# EAGLE board EVO256x64 (EAGLE 7.4.0)
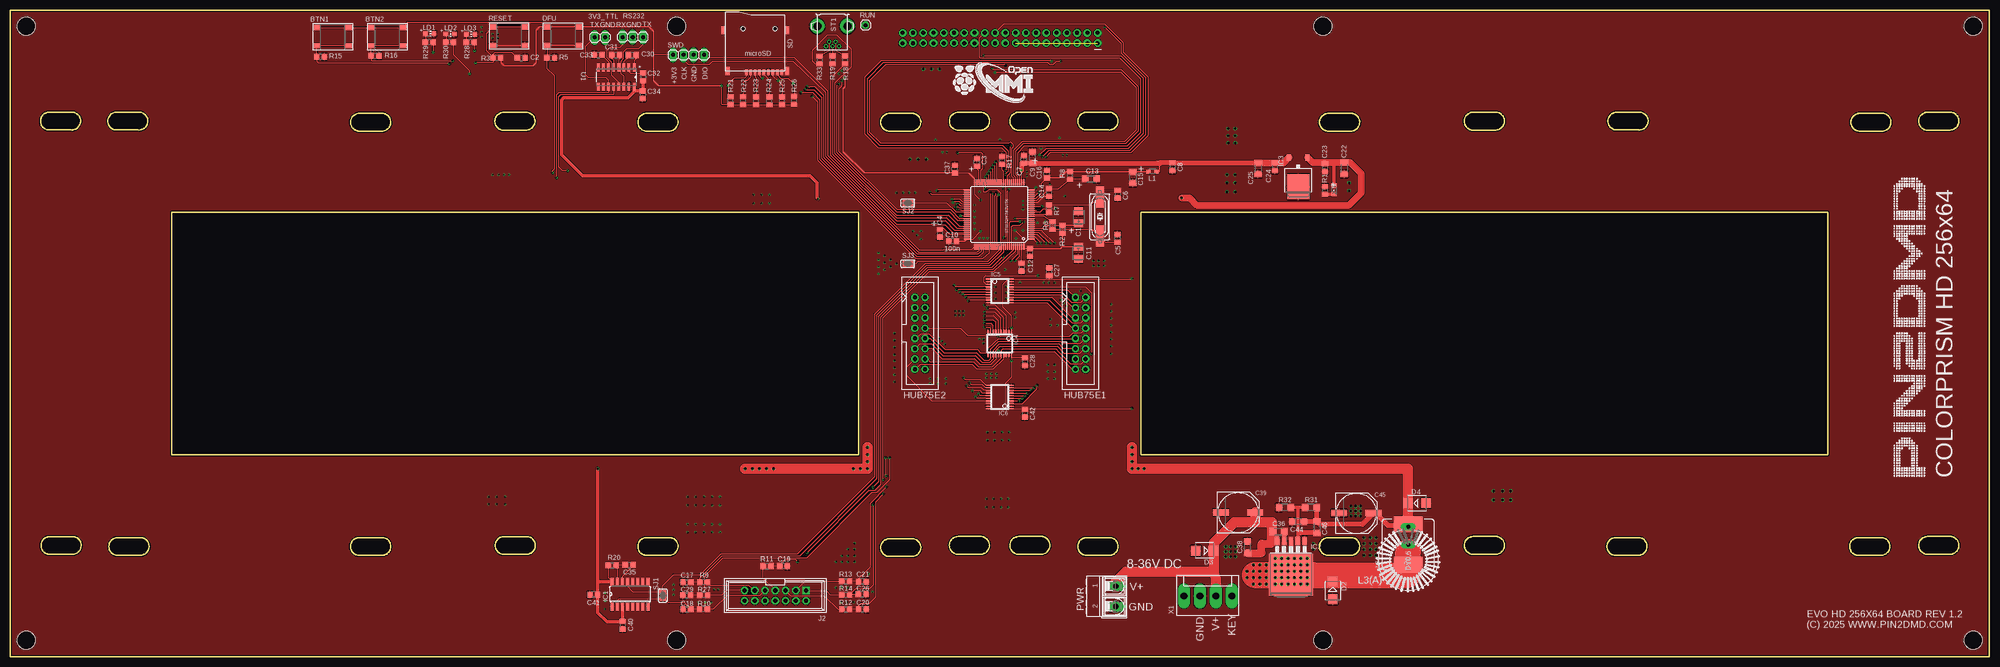
[diagram p1: board, top side]
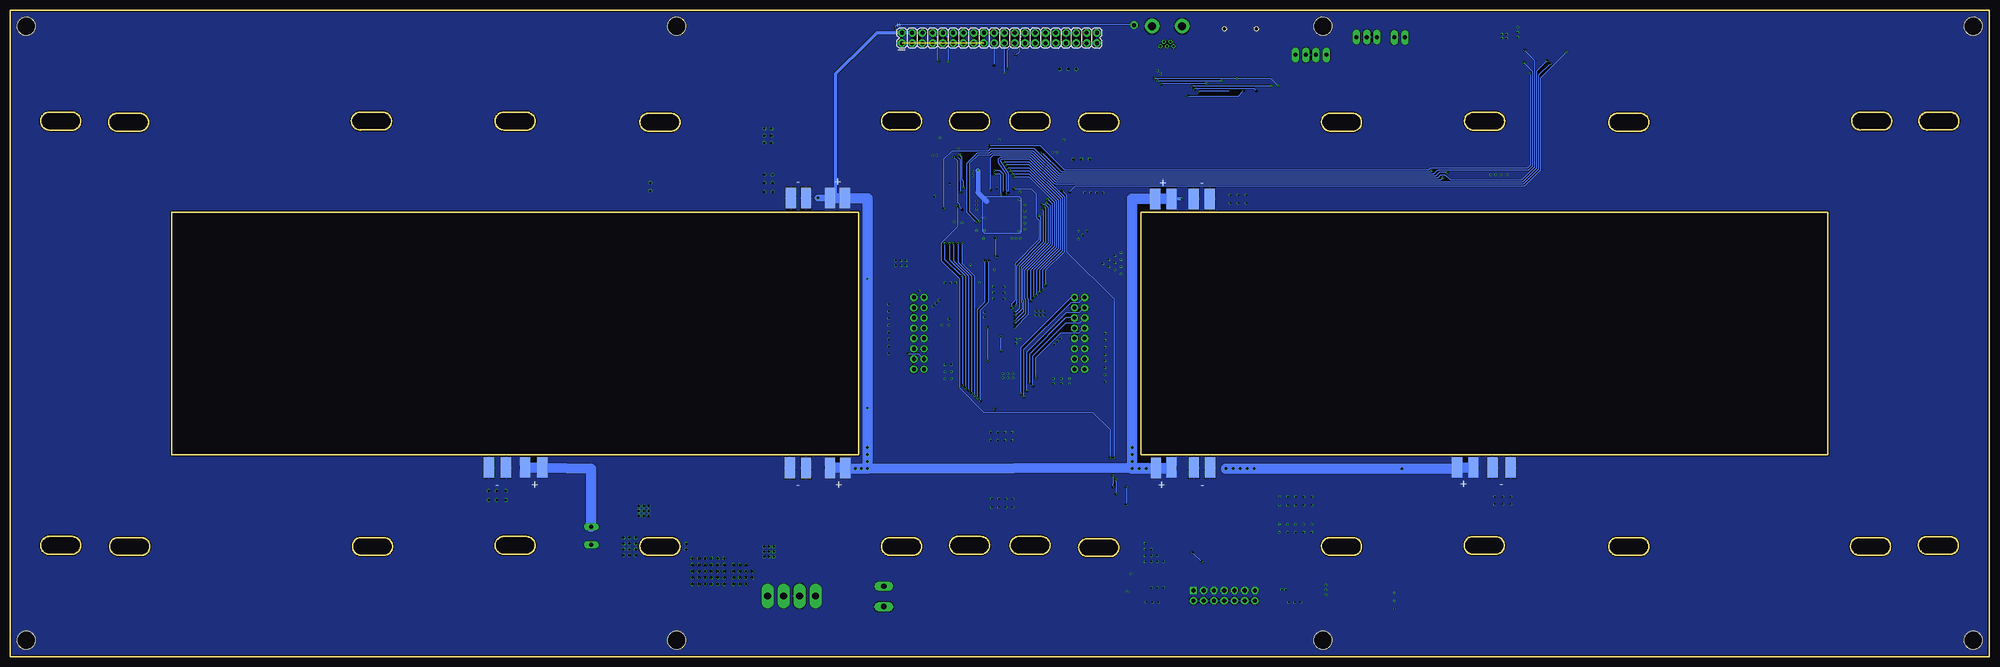
[diagram p2: board, bottom side, seen from below]

Size 490 x 160 mm. Coordinates in mm from the lower left corner, seen from the top.
Outline: 150 segments
Copper layers (1*16): Top 0.035mm / dielectric 1.6mm / Bottom 0.035mm
Design rules "jlcpcb-2layers": minimum track width 5mil, minimum drill 0.3mm, track to track 5mil, track to pad 5mil, pad to pad 5mil, via to via 5mil, smd to smd 5mil, copper to edge 0.2mm, drill to drill 6mil, minimum pad ring 10mil, minimum via ring 3mil, stop-mask expansion 4mil, vias tented up to drill 0mil, thermal gap 10mil
Holes 4.5 mm at 4,156 165,156 486,156 486,4 165,4 4,4 325,156 325,4

## Footprints (pad centres in the part's own frame; a part is rotated, then mirrored left to right if it is on the bottom)
1X02 = drill 1.016 long: 1 -1.27,0; 2 1.27,0
430152043826 = smd 1.55 x 1.3: 1 -3.975,2.25; 2 -3.975,-2.25; 3 3.975,2.25; 4 3.975,-2.25
CT3528 = smd 2 x 2.2: + -1.5,0; - 1.5,0
C0805 = smd 1.3 x 1.5: 1 -0.95,0; 2 0.95,0
C1206 = smd 1.6 x 1.8: 1 -1.4,0; 2 1.4,0
PANASONIC_G = smd 3.9 x 1.6: + 4.25,0; - -4.25,0
SMB = smd 2.4 x 2.4: A 2.2,0; C -2.2,0
2X08-IDC = drill 1 pad 1.778: 1 -1.27,8.89; 2 1.27,8.89; 3 -1.27,6.35; 4 1.27,6.35; 5 -1.27,3.81; 6 1.27,3.81; 7 -1.27,1.27; 8 1.27,1.27; 9 -1.27,-1.27; 10 1.27,-1.27; 11 -1.27,-3.81; 12 1.27,-3.81; 13 -1.27,-6.35; 14 1.27,-6.35; 15 -1.27,-8.89; 16 1.27,-8.89
SO16 = smd 0.66 x 2.032: 1 -4.445,-3.073; 2 -3.175,-3.073; 3 -1.905,-3.073; 4 -0.635,-3.073; 5 0.635,-3.073; 6 1.905,-3.073; 7 3.175,-3.073; 8 4.445,-3.073; 9 4.445,3.073; 10 3.175,3.073; 11 1.905,3.073; 12 0.635,3.073; 13 -0.635,3.073; 14 -1.905,3.073; 15 -3.175,3.073; 16 -4.445,3.073
TO263-5 = smd 1.067 x 2.159: 1 -3.404,-5.791; 2 -1.702,-5.791; 3 0,-5.791; 4 1.702,-5.791; 5 3.404,-5.791 | smd 10.8 x 10.41: 6 0,2.54
TO252 = smd 1 x 1.6: 1 -2.28,-4.8; 2 2.28,-4.8 | smd 5.4 x 6.2: 3 0,2.5
TSSOP20 = smd 0.305 x 0.991: 1 -2.925,-2.918; 2 -2.275,-2.918; 3 -1.625,-2.918; 4 -0.975,-2.918; 5 -0.325,-2.918; 6 0.325,-2.918; 7 0.975,-2.918; 8 1.625,-2.918; 9 2.275,-2.918; 10 2.925,-2.918; 11 2.925,2.918; 12 2.275,2.918; 13 1.625,2.918; 14 0.975,2.918; 15 0.325,2.918; 16 -0.325,2.918; 17 -0.975,2.918; 18 -1.625,2.918; 19 -2.275,2.918; 20 -2.925,2.918
2X20 = drill 1.016 pad 1.88: 1 0,0; 2 0,2.54; 3 2.54,0; 4 2.54,2.54; 5 5.08,0; 6 5.08,2.54; 7 7.62,0; 8 7.62,2.54; 9 10.16,0; 10 10.16,2.54; 11 12.7,0; 12 12.7,2.54; 13 15.24,0; 14 15.24,2.54; 15 17.78,0; 16 17.78,2.54; 17 20.32,0; 18 20.32,2.54; 19 22.86,0; 20 22.86,2.54; 21 25.4,0; 22 25.4,2.54; 23 27.94,0; 24 27.94,2.54; 25 30.48,0; 26 30.48,2.54; 27 33.02,0; 28 33.02,2.54; 29 35.56,0; 30 35.56,2.54; 31 38.1,0; 32 38.1,2.54; 33 40.64,0; 34 40.64,2.54; 35 43.18,0; 36 43.18,2.54; 37 45.72,0; 38 45.72,2.54; 39 48.26,0; 40 48.26,2.54
PINSHRD_PTH_2X07 = drill 1.016 square: 1 -7.62,-1.27 | drill 1.016 octagon: 2 -7.62,1.27; 3 -5.08,-1.27; 4 -5.08,1.27; 5 -2.54,-1.27; 6 -2.54,1.27; 7 0,-1.27; 8 0,1.27; 9 2.54,-1.27; 10 2.54,1.27; 11 5.08,-1.27; 12 5.08,1.27; 13 7.62,-1.27; 14 7.62,1.27
L2012C = smd 1 x 1: 1 -1,0; 2 1,0
ED16 = drill 1.016 long: 1 -8.255,0; 2 -3.81,0
SRR1206 = smd 4 x 7: 1 -5,0; 2 5,0
CHIP-LED0805 = smd 1.2 x 1.2: A 0,-1.05; C 0,1.05
SMD2,54-5,08 = smd 2.54 x 5.08: 1 0,0
CHIPLED_0805 = smd 1.2 x 1.2: A 0,-1.05; C 0,1.05
AK500/2-H = drill 1.321 long: 1 -2.515,0; 2 2.515,0
HC49UP = smd 5.334 x 1.93: 1 -4.826,0; 2 4.826,0
R0805 = smd 1.3 x 1.5: 1 -0.95,0; 2 0.95,0
R1206 = smd 1.6 x 1.803: 1 -1.422,0; 2 1.422,0
1X03 = drill 1.016 long: 1 -2.54,0; 2 0,0; 3 2.54,0
1X01 = drill 1.016 octagon: 1 0,0
MR**-AP*03** = smd 0.6 x 1.5: CARD_DETECTION -6.55,0.3; CLK -2.15,0.3; CMD 0.05,0.3; DAT0 -4.35,0.3; DAT1 -5.45,0.3; DAT2 2.25,0.3; DAT3/CS 1.15,0.3; GND -3.25,0.3; VCC -1.05,0.3 | smd 1 x 2: SHD_1 -7.85,0; SHD_2 6.85,0; SHD_3 -7.85,-10.1; SHD_4 7.85,-10.1 | hole 1: -4.95,-10.5; 3.05,-10.5
SJ = smd 1.168 x 1.6: 1 -0.762,0; 2 0.762,0
USBMINI = drill 0.5: 1 -1.6,3; 2 -0.8,1.8; 3 0,3; 4 0.8,1.8; 5 1.6,3 | drill 2: N1 -3.7,-2; N2 3.7,-2
LQFP100 = smd 1.5 x 0.4: 1 -8,6.075; 25 -8,-6.075; 51 8,-6.075; 75 8,6.075 | smd 1.5 x 0.25: 2 -8,5.5; 3 -8,5; 4 -8,4.5; 5 -8,4; 6 -8,3.5; 7 -8,3; 8 -8,2.5; 9 -8,2; 10 -8,1.5; 11 -8,1; 12 -8,0.5; 13 -8,0; 14 -8,-0.5; 15 -8,-1; 16 -8,-1.5; 17 -8,-2; 18 -8,-2.5; 19 -8,-3; 20 -8,-3.5; 21 -8,-4; 22 -8,-4.5; 23 -8,-5; 24 -8,-5.5; 52 8,-5.5; 53 8,-5; 54 8,-4.5; 55 8,-4; 56 8,-3.5; 57 8,-3; 58 8,-2.5; 59 8,-2; 60 8,-1.5; 61 8,-1; 62 8,-0.5; 63 8,0; 64 8,0.5; 65 8,1; 66 8,1.5; 67 8,2; 68 8,2.5; 69 8,3; 70 8,3.5; 71 8,4; 72 8,4.5; 73 8,5; 74 8,5.5 | smd 0.4 x 1.5: 26 -6.075,-8; 50 6.075,-8; 76 6.075,8; 100 -6.075,8 | smd 0.25 x 1.5: 27 -5.5,-8; 28 -5,-8; 29 -4.5,-8; 30 -4,-8; 31 -3.5,-8; 32 -3,-8; 33 -2.5,-8; 34 -2,-8; 35 -1.5,-8; 36 -1,-8; 37 -0.5,-8; 38 0,-8; 39 0.5,-8; 40 1,-8; 41 1.5,-8; 42 2,-8; 43 2.5,-8; 44 3,-8; 45 3.5,-8; 46 4,-8; 47 4.5,-8; 48 5,-8; 49 5.5,-8; 77 5.5,8; 78 5,8; 79 4.5,8; 80 4,8; 81 3.5,8; 82 3,8; 83 2.5,8; 84 2,8; 85 1.5,8; 86 1,8; 87 0.5,8; 88 0,8; 89 -0.5,8; 90 -1,8; 91 -1.5,8; 92 -2,8; 93 -2.5,8; 94 -3,8; 95 -3.5,8; 96 -4,8; 97 -4.5,8; 98 -5,8; 99 -5.5,8
1X04 = drill 1.016 long: 1 -3.81,0; 2 -1.27,0; 3 1.27,0; 4 3.81,0
SOIC127P600X175-16N = smd 2.057 x 0.61: 1 -4.801,8.89; 2 -4.801,7.62; 3 -4.801,6.35; 4 -4.801,5.08; 5 -4.801,3.81; 6 -4.801,2.54; 7 -4.801,1.27; 8 -4.801,0; 9 0,0; 10 0,1.27; 11 0,2.54; 12 0,3.81; 13 0,5.08; 14 0,6.35; 15 0,7.62; 16 0,8.89
KK-156-4 = drill 1.7 pad 2.184 long: 1 -5.94,0; 2 -1.98,0; 3 1.98,0; 4 5.94,0

## Placement (x,y rotation side)
3V3_TTL  [1X02]  146,153.25 0 top
BTN1  430152043826  [430152043826]  79.89,153.42 180 top
BTN2  430152043826  [430152043826]  93.38,153.42 180 top
C1  1u  [CT3528]  264.49,108.74 90 top
C2  100n  [C0805]  126.54,148.18 0 top
C3  2u2  [C0805]  239.35,122.31 90 top
C4  2u2  [C0805]  230.22,104.82 270 top
C5  22p  [C0805]  274.19,103.5 90 top
C6  22p  [C0805]  274.21,114.47 270 top
C7  100n  [C0805]  250.97,123.06 90 top
C8  100n  [C0805]  287.76,121.25 270 top
C9  2u2  [C1206]  253.11,123.51 90 top
C10  100n  [C0805]  233.33,102.78 180 top
C11  2u2  [CT3528]  264.5,99.92 270 top
C12  100n  [C0805]  252.45,100.02 270 top
C13  1u  [C1206]  267.56,118.26 0 top
C14  100n  [C0805]  257.19,114.88 270 top
C15  1u  [C1206]  277.94,118.55 270 top
C16  100n  [C0805]  256.64,119.42 90 top
C17  47pF  [C0805]  167.55,18.41 0 top
C18  47pF  [C0805]  167.58,11.69 0 top
C19  47pF  [C0805]  191.47,22.42 180 top
C20  47pF  [C0805]  210.99,11.69 180 top
C21  47pF  [C0805]  210.99,18.54 180 top
C22  2u2  [C1206]  330.3,120.86 270 top
C23  100n  [C0805]  325.51,121.03 270 top
C24  100n  [C0805]  313.13,121.24 270 top
C25  2u2  [C1206]  308.95,120.81 270 top
C26  47pF  [C0805]  210.96,15.39 180 top
C27  100n  [C0805]  257.25,95.25 90 top
C28  100n  [C0805]  251.25,73 270 top
C29  47pF  [C0805]  167.51,15.16 0 top
C30  1u  [C0805]  154,148.89 0 top
C31  1u  [C0805]  149.91,148.89 0 top
C32  1u  [C0805]  156.69,143.47 270 top
C33  1u  [C0805]  145.62,148.91 0 top
C34  100n  [C0805]  156.61,139.05 270 top
C35  47p  [C0805]  153.26,22.67 0 top
C36  1uF  [C1206]  313.99,30.98 0 top
C37  100n  [C0805]  233.9,120.64 90 top
C38  1uF  [C1206]  306.33,27.03 90 top
C39  220uF/50V  [PANASONIC_G]  304.01,35.67 0 top
C40  100n  [C0805]  151.64,7.78 270 top
C41  100n  [C0805]  144.52,15.33 180 top
C42  100n  [C0805]  251.25,60.25 270 top
C44  1uF  [C1206]  318.81,33.38 180 top
C45  330uF/25V  [PANASONIC_G]  333.28,35.5 0 top
C46  1uF  [C1206]  323.52,32.03 270 top
D2  SK54  [SMB]  327.42,16.37 270 top
D3  SK54  [SMB]  295.69,26.21 180 top
D4  SK54  [SMB]  348.33,37.98 0 top
DFU  430152043826  [430152043826]  136.86,153.58 0 top
HUB75E1  RGB  [2X08-IDC]  265,80 0 top
HUB75E2  RGB  [2X08-IDC]  225.25,80 0 top
IC1  74LS123D  [SO16]  153.49,15.47 0 top
IC2  XL4015  [TO263-5]  317.09,22.82 180 top
IC3  TS 2940 CP33  [TO252]  318.92,118.73 180 top
IC4  74245PW  [TSSOP20]  245,77.5 180 top
IC5  74245PW  [TSSOP20]  245,90.5 270 top
IC6  74245PW  [TSSOP20]  245,64.25 90 top
J1  RASPBERRYPI-40-PIN  [2X20]  269.24,151.83 0 bottom
J2  CON_HEADER_2X07-PTH-SHROUDED  [PINSHRD_PTH_2X07]  189.44,15.09 180 top
L1  FCM1608KF-601T03  [L2012C]  282.78,120 180 top
L3(A)  47uH/5A  [ED16]  346.13,23.88 270 top
L3A  [SRR1206]  346.08,27.73 90 top
LD1  red  [CHIP-LED0805]  103.87,154.17 270 top
LD2  yellow  [CHIP-LED0805]  108.94,154.1 270 top
LD3  blue  [CHIP-LED0805]  114,154.04 270 top
PAD1  [SMD2,54-5,08]  206.34,46.72 0 bottom
PAD2  [SMD2,54-5,08]  202.49,46.75 0 bottom
PAD3  [SMD2,54-5,08]  196.94,46.79 0 bottom
PAD4  [SMD2,54-5,08]  192.92,46.79 0 bottom
PAD5  [SMD2,54-5,08]  283.22,46.68 180 bottom
PAD6  [SMD2,54-5,08]  287.01,46.68 180 bottom
PAD7  [SMD2,54-5,08]  292.96,46.72 180 bottom
PAD8  [SMD2,54-5,08]  296.98,46.73 180 bottom
PAD9  [SMD2,54-5,08]  286.99,113.47 180 bottom
PAD10  [SMD2,54-5,08]  283.38,113.49 180 bottom
PAD11  [SMD2,54-5,08]  292.93,113.47 180 bottom
PAD12  [SMD2,54-5,08]  296.71,113.47 180 bottom
PAD13  [SMD2,54-5,08]  206.5,113.25 0 bottom
PAD14  [SMD2,54-5,08]  202.5,113.25 0 bottom
PAD15  [SMD2,54-5,08]  197,113.25 0 bottom
PAD16  [SMD2,54-5,08]  193,113.25 0 bottom
PAD17  [SMD2,54-5,08]  131.75,46.75 0 bottom
PAD18  [SMD2,54-5,08]  127.75,46.75 0 bottom
PAD19  [SMD2,54-5,08]  123,46.75 0 bottom
PAD20  [SMD2,54-5,08]  118.5,46.75 0 bottom
PAD21  [SMD2,54-5,08]  362.5,46.75 0 bottom
PAD22  [SMD2,54-5,08]  358.25,46.75 0 bottom
PAD23  [SMD2,54-5,08]  371.5,46.75 0 bottom
PAD24  [SMD2,54-5,08]  367.25,46.75 0 bottom
POWER  Power  [CHIPLED_0805]  327.75,115.52 180 top
PWR  [AK500/2-H]  273.68,14.88 270 top
Q1  8MHz  [HC49UP]  269.8,108.88 270 top
R1  470  [R0805]  325.53,115.35 270 top
R2  0R  [R0805]  260.56,105.74 270 top
R3  100k  [R0805]  120.51,148.18 0 top
R4  47R  [R0805]  250.39,96.38 270 top
R5  100k  [R0805]  133.84,148.18 0 top
R6  0R  [R0805]  258.02,106.69 90 top
R7  220R  [R0805]  257.19,110.84 270 top
R8  47R  [R0805]  262.4,119.09 90 top
R9  220  [R0805]  171.73,18.42 180 top
R10  220  [R0805]  171.67,11.67 180 top
R11  220  [R0805]  187.39,22.41 0 top
R12  220  [R0805]  206.89,11.69 0 top
R13  220  [R0805]  206.86,18.6 0 top
R14  220  [R0805]  206.85,15.33 0 top
R15  100k  [R0805]  76.87,148.5 0 top
R16  100k  [R0805]  90.36,148.66 0 top
R17  10k  [R0805]  245.6,122.8 270 top
R18  22  [R0805]  206.72,147.7 270 top
R19  22  [R0805]  203.61,147.7 270 top
R20  1k  [R0805]  149.08,22.63 0 top
R21  10k  [R0805]  178.32,137.58 90 top
R22  10k  [R0805]  181.51,137.58 90 top
R23  10k  [R0805]  184.7,137.54 90 top
R24  10k  [R0805]  187.96,137.52 90 top
R25  10k  [R0805]  191.14,137.57 90 top
R26  10k  [R0805]  194.13,137.64 90 top
R27  220  [R0805]  171.7,15.19 180 top
R28  680  [R0805]  113.93,152.03 180 top
R29  680  [R0805]  103.79,152.05 180 top
R30  680  [R0805]  108.82,152.03 180 top
R31  11k  [R1206]  322.08,36.91 0 top
R32  3k9  [R1206]  315.56,36.91 0 top
R33  0R  [R0805]  200.35,147.66 270 top
RESET  430152043826  [430152043826]  123.53,153.58 0 top
RS232  [1X03]  154.16,153.32 180 top
RUN  [1X01]  211.75,156.29 0 top
SD  [MR**-AP*03**]  184.47,144.92 180 top
SJ1  [SJ]  161.58,15.13 270 top
SJ2  [SJ]  222.25,112.25 0 top
SJ3  [SJ]  222.25,97.25 0 top
ST1  Mini-USB  [USBMINI]  203.57,154.01 180 top
STM32H743VIT6  STM32  [LQFP100]  244.87,109.42 180 top
SWD  [1X04]  167.95,148.9 0 top
U1  MAX232D  [SOIC127P600X175-16N]  145.6,141.01 270 top
X1  [KK-156-4]  296.5,15 0 top

## Tracks (layer width: path | path; a pad name or v marks a point on that pad's centre or on a via)
3.3V  (1 unrouted)
+3V3  (via drill 0.3, 0.34 pad 0.25)
  Top 0.254: 260.58,101.52 260.69,101.41 | 238.8,118.3 238.79,118.3 STM32H743VIT6.50 238.79,114.45 v240.25,113 | STM32H743VIT6.75 238.34,103.34 v240.25,105.25 | v248.75,105.5 250.94,103.31 STM32H743VIT6.100 251.4,100.97 C12.1 | STM32H743VIT6.11 v248.78,108.42 v248.77,108.41 | STM32H743VIT6.27 250.37,119.83 v250.41,120.35 | SWD.1 159.36,148.9 159.25,149.01 | 315.31,122.2 C24.1 arc45 C24.1 | 308.63,122.2 308.93,122.2 arc45 C25.1
  Top 0.305: 250.44,121.87 C7.1 | v176.13,141.25 176.13,136.81 176.31,136.63 R21.1 R22.1 | 185.66,145.06 185.66,144.76 SD.VCC 185.52,143.73 186.08,143.17 v186.28,143.17 v186.29,143.16 | R22.1 | R22.1 184.63,136.63 R23.1 187.94,136.59 R24.1 191.09,136.57 R25.1 194.06,136.62 R26.1 | BTN1.4 BTN1.2 BTN2.4 BTN2.2 98.48,157.05 131.67,157.05 DFU.1
  Top 0.406: C10.1 236.32,102.78 236.32,102.79 STM32H743VIT6.75 | R2.2 260.58,101.52 260.03,100.97 C12.1 | 260.69,101.41 C11.+ | 252.21,122.14 C9.1 | 234.01,119.61 C37.1 | 234.14,119.75 C37.1 | 253.42,122.17 253.45,122.14 | 284.45,122.14 284.55,122.04 284.55,120.05 284.48,119.98 283.78,119.98 L1.1 | 238.8,118.3 237.42,119.67 C37.1 | C37.1 211.56,119.69 206.25,125 206.25,140.5 206.75,141 v206.75,143.25 206.75,143.5 | 176.25,141.25 v176.13,141.25 160.5,141.25 159.25,142.5 159.25,149.01 159.25,154.75 158.17,155.83 DFU.3 DFU.1 131.08,155.83 130.25,155 130.25,147 129.5,146.25 122.25,146.25 121.5,147 121.5,148.15 R3.2
  Top 1.27: 250.44,121.87 250.44,120.38 v250.41,120.35 | 252.21,122.14 253.45,122.14 284,122.14 | 284,122.14 284.91,122.14 | C9.1 250.41,122.11 C7.1 | 284.86,122.25 287.25,122.25 287.3,122.2 C8.1 308.63,122.2 | 284.86,122.25 284,122.14 | 284.86,122.25 284.76,122.25 284.55,122.04
  Top 1.676: IC3.2 315.31,122.2 308.63,122.2
  Bottom 0.254: 239.65,105.5 239.65,105.15 240.05,104.75 248.75,104.75 249.35,105.35 249.35,105.5 | 239.65,105.5 239.65,113 | 239.65,113 239.65,113.25 240.15,113.75 248.25,113.75 | 248.25,113.75 248.75,113.75 249.35,113.15 249.35,108.75 | 249.35,108.75 249.35,105.5 | v240.25,113 239.65,113 | v240.25,105.25 239.9,105.25 239.65,105.5 | v248.75,105.5 249.35,105.5 | 250.41,114.81 249.75,114.25 248.25,112.75 248.25,113.75 | v248.77,108.41 249.01,108.41 249.35,108.75 | v206.75,143.25 206.75,143.16
  Bottom 0.305: 206.81,143.16 206.75,143.16 v186.29,143.16 178.04,143.16 v176.13,141.25
  Bottom 1.27: v250.41,120.35 250.41,114.81 248.25,112.65
  pour Bottom: 239.65,113.25 240.15,113.75 248.75,113.75 249.35,113.15 249.35,105.35 248.75,104.75 240.05,104.75 239.65,105.15
+5V  (via drill 0.34 pad 0.25, 0.35, 0.5, 0.6)
  Top 0.152: 145.5,15.38 C41.1 | R20.1 | C23.1 325.5,122 325.5,122.25
  Top 0.254: IC1.16 148.13,19.47 R20.1 | IC5.1 247,93.42 | 247,93.42 IC5.20 257.25,93.42 | 257.25,93.42 277.68,93.42 v277.75,93.5 | 247,93.42 245.75,92.17 245.75,86.5 247.93,84.33 247.9,81.35 v247.9,81.4 247.93,81.38 IC4.1 | IC6.20 v246.25,61.33 | 251.25,61.33 IC6.1 v246.25,61.33 | 251.25,61.33 277.57,61.33 v277.75,61.5 | 247.91,71 v247.9,73.25 247.93,73.28 IC4.20 247.93,74 247.9,74 247.9,73.95 C28.1 | 247.91,71 247.93,69.17 246.25,67.5 v246.25,61.33 | C27.1 257.25,93.42 | 247.91,71 | C42.1 251.25,61.33
  Top 0.305: 149.05,18.5 IC1.16
  Top 0.813: IC1.3 151.64,12.4 C40.1 151.49,8.57 147.79,8.57 145.5,10.87 145.5,15.38 145.5,18.5 | 149.05,18.5 145.5,18.5 | C34.1 154.49,140 U1.16 | C34.1 156.69,140 C32.2 | 145.5,18.5 v145.5,46.5 | POWER.A 327.75,122.25 | C34.1 154.75,140 153,138.25 137,138.25 136.5,137.75 136.5,124.25 141.75,119 198,119 199.75,117.25 199.75,113.5 v200,113.25
  Top 1.27: L3A.2 346.13,32.73 | 346.13,32.73 L3(A).1 345.8,32.48 341.08,32.48 338.13,35.43 337.53,35.43 | C46.1 320.21,33.43 C44.1 | C46.1 323.51,36.89 R31.2 | C45.+ 337.53,35.43 | 337.53,35.43 334.83,32.73 324.22,32.73 C46.1 | 346.13,32.73 346.13,37.48 D4.C
  Top 1.676: IC3.1 322.48,122.25 325.25,122.25 325.5,122.25 327.75,122.25 C22.1 331.75,122.25 334.5,119.5 334.5,114.75 331.5,111.75 293.75,111.75 292,113.5 v290,113.5
  Top 2.54: L3A.2 346.08,46.5 v277.75,46.5 v277.75,51.75 | v189,46.5 v208.75,46.5 v210.5,46.5 v212.25,46.5 v212.25,51.75 | 188.75,46.5 v187.25,46.5 v182,46.5
  Bottom 0.254: v247.9,73.25 v247.9,81.4
  Bottom 0.813: v200,113.25 203,113.25 | 285.32,113.47 285.61,113.76 285.61,144.21 277.99,151.83 277.93,151.83 275.34,154.43 269.3,154.43 J1.2 J1.4
  Bottom 1.27: PAD2.1 PAD1.1
  Bottom 1.676: PAD9.1 289.97,113.47 v290,113.5
  Bottom 2.54: PAD5.1 283.2,47.31 | PAD6.1 283.75,46.68 | 283.75,46.68 PAD5.1 | PAD9.1 285.32,113.47 284.2,113.47 PAD10.1 277.75,113.49 v277.75,93.5 v277.75,61.5 v277.75,51.75 v277.75,50 v277.75,48.25 v277.75,46.5 v279.25,46.5 v280.75,46.5 | 283.75,46.75 283.75,46.68 | PAD14.1 203,113.25 PAD13.1 212.25,113.25 v212.25,51.75 v212.25,50 v212.25,48.25 v212.25,46.5 v210.5,46.5 v208.75,46.5 202.49,46.5 PAD2.1 280.5,46.5 v280.75,46.5 | PAD21.1 PAD22.1 346.13,46.47 L3(A).1 | PAD18.1 PAD17.1 131.75,46.5 v145.5,46.5 v182,46.5 v183.75,46.5 v185.5,46.5 v187.25,46.5 v189,46.5 | v280.75,46.5 283.04,46.5 PAD5.1
B0_1  (via drill 0.35)
  Top 0.254: IC6.14 240.78,65.22 240.25,65.75 v238.25,65.75
  Bottom 0.254: HUB75E2.3 224.15,86.35 225.4,85.1 228.6,85.1 238.25,75.5 v238.25,65.75
B0_2
  Top 0.254: IC5.14 259.98,89.53 263.25,86.25 263.63,86.25 HUB75E1.3
B1_1  (via drill 0.35)
  Top 0.254: IC6.11 241.57,67.17 240.25,68.5 236.5,68.5 v236,69
  Bottom 0.254: HUB75E2.7 arc-45 224.41,81.09 225.5,80 230,80 236,74 v236,69
B1_2
  Top 0.254: IC5.11 256.68,87.58 263,81.25 263.71,81.25 HUB75E1.7
BOOT0  (via drill 0.3, 0.34 pad 0.25)
  Top 0.254: v250.87,107.55 250.07,106.75 248.25,106.75 247.89,106.39 247.89,101.44 STM32H743VIT6.94 | v134.25,119.75 134.25,120.25 134.75,120.75
  Top 0.305: DFU.2 DFU.4 DFU.2 R5.1 133,148.08 133,145.5 134.75,143.75 134.75,120.75
  Bottom 0.254: v250.87,107.55 250.9,107.58 250.9,107.65 251.02,107.65 253.15,109.78 253.15,122.1 250.5,124.75 247.5,124.75 247,125.25 236.75,125.25 230.5,119 137,119 136,120 134.5,120 v134.25,119.75
CLK1
  Top 0.254: IC6.17 241.81,63.25 228.25,63.25 222,69.5 222,71.67 HUB75E2.13
CLK2  (via drill 0.34)
  Top 0.254: IC5.17 266.27,91.47 267.75,90 v267.75,75
  Bottom 0.254: v267.75,75 265.08,75 HUB75E1.13
G0_1  (via drill 0.35)
  Top 0.254: IC6.15 240.18,64.58 v239.75,65
  Bottom 0.254: v239.75,65 239.75,76.5 227.36,88.89 HUB75E2.2
G0_2
  Top 0.254: HUB75E1.2 266.27,88.87 265,87.6 262.9,87.6 260.32,90.17 IC5.15
G1_1  (via drill 0.35)
  Top 0.254: v237.5,67.75 238,67.25 240.75,67.25 241.47,66.53 IC6.12
  Bottom 0.254: HUB75E2.6 228.69,83.81 237.5,75 v237.5,67.75
G1_2
  Top 0.254: HUB75E1.6 266.27,83.77 265,82.5 263,82.5 262.62,82.88 262.5,83 257.27,88.22 IC5.12
GND  (via drill 0.3, 0.34 pad 0.25, 0.6)
  Top 0.254: C14.2 257.15,113.89 255.93,113.89 254.46,112.42 STM32H743VIT6.19 | STM32H743VIT6.74
  Top 0.305: RESET.2 RESET.4
  other vias: 257.38,117.06 261.19,113.89 254.35,107.38 256.36,107.61 147.28,15.81 147.28,13.8 147.28,11.78 331.93,37.23 333.13,37.23 334.33,37.23 331.93,36.03 333.13,36.03 334.33,36.03 331.93,34.83 333.13,34.83 334.33,34.83 336.72,29.43 338.14,29.43 338.14,27.98 336.74,27.98 338.13,26.53 336.73,26.53 322.62,26.53 322.61,27.9 336.73,25.08 338.15,25.08 251.69,120 251.69,119 250.75,110.75 250.75,105.5 238.75,111.75 238.75,105.75 240,115 249,103.5 335.13,29.43 335.13,27.98 335.13,26.53 335.13,25.08 301.25,119.25 303.25,119.25 301.25,117.25 303.25,117.25 301.25,115 303.25,115 331.5,117.25 331.5,115.25 116.75,155.75 116.75,154.5 116.75,153.25 119.5,154 119.5,153 120.75,153 120.75,154 245.75,115.75 244,88.5 244,90 244,91.5 250,92.5 246.25,95.75 252.25,97 246.5,91.5 246.5,90 246.5,88.5 256,92.5 257.25,92.5 258.5,92.5 257.5,83.5 257.5,82 259.25,82 260,88.25 260.75,87.5 261.5,86.75 257,72.25 258.5,72.25 243,69 241.75,69 258.5,70.5 257,68.75 257,70.5 227.75,68.75 229.75,68.75 229.75,67.5 227.75,67.5 212.5,20.5 213.5,16 205.75,13.5 207.25,13.5 208.75,13.5 207.5,17 206,17 204.5,17 173.5,13.5 172,13.5 170.5,13.5 164.25,15.25 164.25,16.5 164.25,17.75 174.25,16.5 175.25,16.5 204.5,23.5 206,23.5 207.5,23.5 209,23.5 209,25 209,26.5 209,28 207.5,26.5 207.5,25 206,25 215,100 215,98.25 215,96.5 215,94.75 216.5,95.75 216.5,97.5 216.5,99.25 218,98.25 218,96.5 219.5,97.25 250.75,111.75 250.75,112.75 240,103.5 241,103.5 242,103.5 238.75,107.25 238.75,108.75 238.75,110.25 242,55.5 243.75,55.5 245.5,55.5 247.25,55.5 242,53.5 243.75,53.5 245.5,53.5 247.25,53.5 241.75,39 243.5,39 245.25,39 247,39 241.75,37 243.5,37 245.25,37 247,37 219,80 219,78.25 219,76.5 219,74.75 219,73.25 219,71.5 219,69.75 219,68 272.5,87.25 272.5,85.5 272.5,83.75 272.5,82 272.5,80.25 272.5,78.5 272.5,76.75 272.5,75 300.93,27.23 302.13,27.23 303.33,27.23 300.93,25.98 302.13,25.98 303.33,25.98 300.93,24.73 302.13,24.73 303.33,24.73 119.5,119.25 121,119.25 122.25,119.25 123.5,119.25 223.5,105.25 224.5,104.25 225.5,103.25 225.5,105.25 268.25,98 269.5,98 270.75,98 270.75,96.75 269.5,96.75 268.25,96.75 367.25,41 369.5,41 371.5,41 371.5,38.75 369.5,38.75 367.25,38.75 167.75,39.5 118.5,39.5 120.5,39.5 122.5,39.5 122.5,37.75 120.5,37.75 118.5,37.75 169.75,39.5 171.75,39.5 173.75,39.5 175.75,39.5 167.75,37.5 169.75,37.5 171.75,37.5 173.75,37.5 175.75,37.5 167.75,32.75 169.75,32.75 171.75,32.75 173.75,32.75 175.75,32.75 167.75,30.75 169.75,30.75 171.75,30.75 173.75,30.75 175.75,30.75 265,90.5 219.5,114.75 221,114.75 222.5,114.75 224,114.75 241.75,70 243,70 244.25,70 244.25,69 231.75,68.75 231.75,67.5 230,78.75 230.75,78 231.5,77.25 234,85.5 235,85.5 236,85.5 236,84.5 235,84.5 234,84.5 240,78.5 241,78.5 241,77.5 248.75,85.25 248.75,84 258.5,68.75 184,114.25 186,114.25 188,114.25 188,112.25 186,112.25 184,112.25 205.25,144.25 206,145 255.24,125.84 260.58,124.06 261.59,124.06 231.87,124.83 230.86,124.83 229.08,127.87 245.08,127.87 259.81,128.38 301.5,127.12 301.5,128.9 301.5,130.68 303.28,130.68 303.28,128.9 303.28,127.12 230.13,145.41 228.1,145.41 226.07,145.41 226.83,123.06 224.8,123.06 222.76,123.06
  pour Bottom: 0,160 490,160 490,0 0,0
  pour Top: 0,160 0,0 490,0 490,160
N$1
  Top 0.254: R6.1 267.8,105.73 Q1.2 271.18,102.55 C5.1
N$2
  Top 0.254: R7.1 267.42,111.79 Q1.1 270.19,115.56 C6.1
N$3
  Top 0.813: R1.2 327.69,114.4 POWER.C
N$4
  Top 0.254: J2.13 177.38,16.36 176.19,15.18 172.66,15.18 R27.1
N$5
  Top 0.254: J2.11 184.25,16.36 182.93,17.55 173.42,17.55 R9.1
N$6
  Top 0.254: J2.9 186.82,16.36 185.5,15.04 177.45,15.04 174.08,11.68 R10.1
N$7
  Top 0.254: J2.7 186.44,19.36 R11.1
N$8
  Top 0.254: J2.5 193.23,15.11 201.49,15.11 204.91,11.69 R12.1
N$9
  Top 0.254: J2.3 196.76,18.6 R13.1
N$10
  Top 0.152: 152.25,22.62 C35.1 | 150.38,18.62 IC1.15 | 150.38,22.62 150.12,22.62 R20.2 150.38,22.62
  Top 0.254: IC1.15 150.32,22.57 150.38,22.62 150.42,22.67 C35.1
N$11
  Top 0.254: J2.1 197.12,16.3 202.08,16.3 203.05,15.33 R14.1
N$13
  Top 0.254: C30.2 154.96,147.91 154.51,147.47 154.51,145.84 U1.1
N$14
  Top 0.254: C30.1 153.06,148.34 151.93,147.22 151.93,145.82 U1.3
N$15
  Top 0.254: C31.2 150.86,147.85 150.68,147.67 U1.4
N$16
  Top 0.254: C31.1 148.96,148.13 149.43,147.67 149.43,145.83 U1.5
N$17
  Top 0.254: C33.2 146.57,148.81 148.17,147.2 148.17,145.85 U1.6
N$18
  Top 0.152: 156.62,144.5 C32.1
  Top 0.254: U1.2 153.22,144.8 153.65,144.36 156.63,144.36 C32.1
N$19
  Top 0.254: LD1.A 102.82,152.07 R29.2
N$20  (via drill 0.6 pad 0.25)
  Top 0.406: L3A.1 341.57,21.23 346.08,22.61
  Top 0.813: v317.95,22.7 317.18,23.48 317.08,23.48 317.08,23.42 v316.37,22.7 | v317.95,21.11 317.95,20.64 317.63,20.32 317.95,20 v317.95,19.53 | IC2.6 317.2,20.28 v317.95,19.53 | 317.08,21.85 317.08,21.83 v316.37,21.11 | 316.98,20.16 316.98,20.14 v316.37,19.53 | v316.37,17.94 v316.37,19.53 | v316.37,21.11 v314.78,22.7 | v314.78,22.7 v313.19,24.29 v313.19,22.7 v313.19,21.11 v313.19,19.53 v313.19,17.94 v314.78,17.94 v314.78,19.53 v314.78,21.11 v314.78,22.7 | v314.78,24.29 v314.78,22.7 | v317.95,24.29 v316.37,24.29 v316.37,22.7 | v316.37,22.7 v316.37,21.11 | v316.37,21.11 v316.37,19.53 | v316.37,19.53 316.37,17.78 317.79,17.78 v317.95,17.94 v317.95,19.53 | v317.95,19.53 v317.95,22.7 | v317.95,22.7 v317.95,24.29 | v317.95,24.29 v319.54,24.29 v319.54,22.7 v319.54,21.11 v321.13,21.11 | v319.54,19.53 v319.54,17.94 v321.13,17.94 v321.13,19.53 v321.13,21.11 | v321.13,21.11 v321.13,22.7 v321.13,24.29 | v309.38,21.11 v307.8,21.11 v307.8,22.7 | v307.8,22.7 v309.38,22.7 v310.97,22.7 v310.97,21.11 | v310.97,17.94 v310.97,19.53 v309.38,19.53 | v309.38,19.53 v309.38,17.94 | v309.38,19.53 v307.8,19.53 v307.8,17.94 | v306.21,19.53 306.21,18.5 | 307.62,22.7 v307.8,22.7
  Top 1.27: 317.08,24.98 317.08,23.48 | IC2.3 317.08,25.08 | 317.08,25.08 317.08,24.98 | 317.08,21.85 IC2.6 | L3(A).2 346.08,26 | D2.C 322.63,20.18 | v317.95,24.29 317.87,24.29 317.08,25.08 | 316.21,24.29 v316.37,24.29 317.05,24.98 317.08,24.98 | v307.8,19.53 v306.21,21.11 306.37,21.11 | v306.21,19.53 306.7,20.02 308.11,20.18 308.34,20.23 306.37,21.11 | 306.37,21.11 v307.8,21.11 | 306.37,21.11 307.95,19.53
  Top 1.93: 317.08,21.85 317.08,24.98
  Top 6.452: 317.08,21.85 317.55,20.18 | 346.08,26 346.08,22.61 346.1,20.18 322.63,20.18 308.11,20.18 308.1,20.16 316.98,20.16 IC2.6
N$21
  Top 0.813: 318.82,28.42 318.82,36.96 | 318.82,36.96 320.65,36.96 R31.1 | 318.82,36.96 316.98,36.96 R32.2 | 318.82,28.42 318.83,30.6 319.33,30.6 | IC2.2 318.82,28.42
  Top 1.27: C46.2 319.33,30.6
N$22
  Top 0.254: IC1.14 151.62,18.59 151.62,19.93 154.21,22.52 C35.2
N$23
  Top 0.254: LD3.A 112.95,152.07 R28.2
N$24
  Top 1.27: C36.2 IC2.4
N$25
  Top 0.305: ST1.4 202.77,149.93 R33.1
N$26
  Top 0.254: LD2.A 107.89,152.09 R30.2
N$39
  Top 0.305: ST1.3 203.57,149.02 R19.1
N$40
  Top 0.305: ST1.2 204.37,150.12 R18.1
PA0  (via drill 0.3)
  Top 0.254: STM32H743VIT6.22 253.51,113.92 arc45 253.69,113.99 v254.63,114.94 | v255.52,123.7 257.18,125.35 277.24,125.35 281.18,129.29 281.18,143.26 275.08,149.35 275.08,151.64 v271.02,155.7
  Bottom 0.254: v254.63,114.94 254.63,117.47 254.76,117.6 254.76,122.94 v255.52,123.7 | v271.02,155.7 270.26,156.46 211.84,156.46 RUN.1
PA3  (via drill 0.3, 0.3 pad 0.3)
  Top 0.254: STM32H743VIT6.25 253.5,115.5 v254,115.99 | v254.84,124.18 256.54,125.87 276.86,125.87 280.53,129.54 280.53,143.15 275.1,148.57 241.32,148.57 v241.05,148.84
  Bottom 0.254: v254,115.99 254,117.69 254.31,118 254.31,123.64 v254.84,124.18 | v241.05,148.84 240.03,149.86 240.03,153.1 J1.26
PA4
  Top 0.254: STM32H743VIT6.28 249.87,118.99 249.48,119.38 249.48,124.74 251.18,126.43 276.57,126.43 279.96,129.82 279.96,142.89 274.78,148.07 240.29,148.07 240.03,148.34 240.03,153.11 J1.24
PA5  (via drill 0.3)
  Top 0.254: STM32H743VIT6.29 249.37,118.88 249,119.25 249,125.15 249.05,125.15 250.89,127 276.29,127 279.4,130.1 279.4,141.08 275.19,145.29 243.33,145.29 v243.08,145.54
  Bottom 0.254: v243.08,145.54 243.08,150.05 J1.23
PA6  (via drill 0.3)
  Top 0.254: STM32H743VIT6.30 248.87,118.63 248.5,119 248.5,125.45 248.92,125.87 | 248.92,125.87 | 248.92,125.87 250.61,127.56 276.01,127.56 278.83,130.38 278.83,140.8 275.16,144.47 243.9,144.47 v243.84,144.53
  Bottom 0.254: v243.84,144.53 J1.21
PA7  (via drill 0.3)
  Top 0.254: STM32H743VIT6.31 248.37,118.52 248.07,118.81 248.07,125.87 248.35,126.15 248.35,126.72 247.79,127.28 247.51,127.28 247.22,127 215.62,127 212.79,129.82 212.79,142.49 216.86,146.56 246.13,146.56 v246.38,146.3
  Bottom 0.254: J1.19 v246.38,146.3
PA10
  Top 0.254: STM32H743VIT6.69 235.15,106.42 232.31,109.26 219.49,109.26 204.25,124.5 204.25,142 208.25,146 208.25,150.25 204.75,153.75 202.25,153.75 198.5,150 198.5,147.5 199.25,146.75 200.31,146.75 R33.2 | STM32H743VIT6.69 | STM32H743VIT6.69
PA11
  Top 0.254: STM32H743VIT6.70 234.52,105.92 231.83,108.61 | 231.83,108.61 219.39,108.61 203.75,124.25 203.75,143.78 R18.2 | 231.83,108.61 231.84,108.62
  Top 0.305: 206.83,146.71 R18.2
PA12
  Top 0.254: 236.69,105.41 236.25,105.41 | 236.25,105.41 233.95,105.41 231.53,107.83 219.42,107.83 203.25,124 203.25,146.39 R19.2 | STM32H743VIT6.71 236.25,105.42 236.25,105.41
PA13
  Top 0.254: 233.42,104.92 STM32H743VIT6.72 | 228.17,106.9 219.6,106.9 202.5,124 202.5,140 202.33,140 194.17,148.16 172.5,148.16 SWD.4
  Top 0.305: 228.17,106.9 231.42,106.9 233.42,104.92
PA14
  Top 0.254: STM32H743VIT6.76 238.05,100.7 231.02,100.72 230.94,100.71 225.04,100.71 202,123.75 202,139.5 193.98,147.24 173.77,147.24 173,146.47 167.92,146.47 166.79,147.6 166.79,148.79 SWD.2
PB0  (via drill 0.3 pad 0.3, 0.34 pad 0.25)
  Top 0.254: STM32H743VIT6.34 246.87,119.03 247.51,119.66 247.54,119.66 247.62,119.75 v247.62,126.5 | v113.75,144.25 113.75,145 109.75,149 109.75,152.01 R30.1
  Top 0.305: R30.1 109.77,151.43
  Bottom 0.254: v113.75,144.25 113.5,144 113.5,121.75 114.25,121 138.25,121 138.75,120.5 229,120.5 235,126.5 v247.62,126.5
PB1  (via drill 0.34, 0.34 pad 0.25)
  Top 0.254: C26.2 209.94,15.33 R14.2 209.43,16.96 212.94,16.96 213.65,17.67 v213.65,37.6 | STM32H743VIT6.35 246.37,103.86 v246.11,103.6 v246.1,103.6 | v245.75,99 245.7,99 242.9,96.25 227,96.25 215,84.25 215,43.25 v213.65,41.9
  Bottom 0.254: v246.1,103.6 246.1,99.35 v245.75,99 | v213.65,41.9 v213.65,37.6
PB2
  Top 0.254: STM32H743VIT6.36 245.87,120.13 245.5,120.5 245.5,121.75 R17.2 245.35,121.85
PB4
  Top 0.254: C17.2 170.77,18.41 R9.2 170.78,19.53 176.25,25 195.5,25 214.5,44 214.5,84.5 226.75,96.75 242.5,96.75 245.87,100.12 STM32H743VIT6.90
PB6  (via drill 0.34 pad 0.25)
  Top 0.254: 246.88,115.04 246.94,115.14 | STM32H743VIT6.92 246.88,115.04 | 246.88,115.04 246.88,115.13 v247.25,115.5 | v135.25,118.5 135.25,139 135.75,139.5 148,139.5 148.13,139.63 U1.11 148.13,142.62 147.5,143.25 143.25,143.25 142.5,144 142.5,151.02 3V3_TTL.1
  Bottom 0.254: v247.25,115.5 247.25,123.5 246.5,124.25 237.25,124.25 231,118 135.75,118 v135.25,118.5
PB7  (via drill 0.3, 0.34 pad 0.25)
  Top 0.254: v250.04,107.72 250.01,107.69 247.69,107.69 247.37,107.37 247.37,105.12 247.37,105.11 STM32H743VIT6.93 | v115,150 115,151.91 R28.1
  Top 0.305: 114.82,152.03 R28.1
  Bottom 0.254: v250.04,107.72 250.04,107.8 252.3,110.07 252.3,122.2 250.25,124.25 247.25,124.25 246.75,124.75 237,124.75 230.75,118.5 136.5,118.5 135.75,119.25 134.75,119.25 133.5,118 115.75,118 112.5,121.25 112.5,147.5 v115,150
PB8  (via drill 0.34 pad 0.25)
  Top 0.254: R11.2 190.5,22.41 C19.2 190.52,22.77 191.67,23.92 194.58,23.92 v195,23.5 | STM32H743VIT6.95 248.38,100.63 243.25,95.75 227.25,95.75 215.5,84 215.5,42.5 214,41 212.5,41 v197.25,25.75
  Bottom 0.254: v197.25,25.75 v195,23.5
PB9  (via drill 0.34 pad 0.25)
  Top 0.254: R12.2 C20.2 210.04,12.54 210.75,13.25 212.75,13.25 214.35,14.85 214.35,38.35 v216.25,40.25 | STM32H743VIT6.96 248.87,100.37 243.5,95.25 227.5,95.25 216,83.75 216,44 v216.25,43.75
  Bottom 0.254: v216.25,43.75 v216.25,40.25
PB11  (via drill 0.34 pad 0.25)
  Top 0.254: STM32H743VIT6.47 240.37,120.37 240.87,120.87 | 240.87,123.41 240.87,124.37 240.5,124.74 v234.49,124.74 | v138,120.25 136.75,120.25 135.75,121.25 135.75,138.5 136.25,139 149.25,139 149.41,139.16 U1.12
  Top 0.305: 240.87,120.87 240.87,123.41
  Bottom 0.254: v234.49,124.74 229.75,120 138.25,120 v138,120.25
PB12  (via drill 0.34 pad 0.25)
  Top 0.254: C21.2 209.98,18.6 | 209.98,18.6 R13.2 | 209.98,18.6 209.98,19.23 213,22.25 213,38 v217,42 | STM32H743VIT6.51 229.75,115.5 v229.5,115.25 | v216.75,49.25 216.75,45 v217,44.75
  Bottom 0.254: v229.5,115.25 228.5,114.25 228.5,100.25 216.75,88.5 v216.75,49.25 | v217,44.75 217,42.75 v217,42
PB14  (via drill 0.3, 0.34 pad 0.25)
  Top 0.254: 228.15,114.42 STM32H743VIT6.53
  Top 0.305: 228.15,114.42 v227.68,114.88 | R29.1 v104.74,149.57
  Bottom 0.254: v227.68,114.88 227.68,115.07 226.25,116.5 115,116.5 111,120.5 111,143.31 v104.74,149.57 104.75,149.56
PC0  (via drill 0.3 pad 0.3)
  Top 0.254: STM32H743VIT6.15 254.07,110.42 v254.28,110.63 | v256.45,123.64 257.61,124.8 277.65,124.8 281.85,129 281.85,143.34 275.59,149.61 275.59,151.89 271.02,156.46 245.93,156.46 J1.22
  Bottom 0.254: v254.28,110.63 | v254.28,110.63 254.84,111.19 254.84,111.84 255.38,112.38 255.38,122.57 v256.45,123.64
PC2  (via drill 0.34 pad 0.25)
  Top 0.254: C29.2 170.72,15.16 R27.2 170.94,15.44 171.75,16.25 171.75,19.75 176.5,24.5 197.25,24.5 213.25,40.5 214.5,40.5 217.75,43.75 v217.75,49.25 | STM32H743VIT6.17 252.89,111.4 v255.4,111.4
  Bottom 0.254: v255.4,111.4 255.4,106.4 259.5,102.3 259.5,98 255,93.5 255,66.5 249,60.5 222,60.5 217.75,56.25 v217.75,49.25
PC7  (via drill 0.3, 0.34)
  Top 0.254: 236.86,108.91 236.25,108.92 | 236.25,108.92 235.87,108.92 235.69,109.11 v235.3,109.11 | STM32H743VIT6.64 236.25,108.92 | IC4.3 246.62,84.38 244,87 v241.25,87
  Bottom 0.254: v241.25,87 240.75,87.5 240.75,96.75 234.75,103 234.75,108.57 v235.3,109.11
PC7_
  Top 0.254: HUB75E2.15 224.11,71.11 225.35,72.35 238.15,72.35 239.25,71.25 243.5,71.25 246,73.75 246,74.56 IC4.17 245.97,75.22 246.25,75.5 258.5,75.5 262.89,71.11 HUB75E1.15
PC8  (via drill 0.3, 0.34 pad 0.25)
  Top 0.254: STM32H743VIT6.65 235.06,108.42 232.83,110.65 219.6,110.65 205.25,125 205.25,140.5 206,141.25 206,142.44 v205.92,142.52
  Top 0.305: SD.DAT0 188.82,143.78 190.09,142.51 | 190.09,142.51 191.16,141.44 191.16,138.54 R25.2 | v190.1,142.52 190.09,142.51
  Bottom 0.305: v205.92,142.52 204.75,142.52 v190.1,142.52
PC9  (via drill 0.3, 0.34 pad 0.25)
  Top 0.254: STM32H743VIT6.66 234.53,107.92 234.53,107.94 232.51,110.05 219.45,110.05 204.75,124.75 204.75,141.35 v205.03,141.63
  Top 0.305: SD.DAT1 189.92,143.98 189.94,143.98 190.77,143.15 192.59,143.15 v193.85,141.88 194.14,141.6 R26.2
  Bottom 0.305: v205.03,141.63 205.01,141.63 204.75,141.9 v193.85,141.88
PC10  (via drill 0.3, 0.34 pad 0.25)
  Top 0.254: STM32H743VIT6.78 239.88,101.42 239.88,100.46 239.29,100.12 224.88,100.12 201.5,123.5 201.5,138.75 199.25,141 198.25,141 198,141 v197.25,141
  Top 0.305: SD.DAT2 182.22,143.52 181.85,143.16 179.22,143.16 177.71,141.64 v177.71,141.25 177.71,138.46 R21.2
  Bottom 0.305: v177.71,141.25 197,141.25 v197.25,141
PC11  (via drill 0.3, 0.34 pad 0.25)
  Top 0.254: STM32H743VIT6.79 240.38,101.42 240.38,100.23 239.49,99.56 224.69,99.56 201,123.25 201,138.25 199,140.25 v196.75,140.25
  Top 0.305: SD.DAT3/CS 183.32,143.35 182.49,142.52 182,142.52 181.5,142.02 v181.5,139.98 181.5,138.44 R22.2
  Bottom 0.305: v181.5,139.98 182.13,140.62 196.38,140.62 v196.75,140.25
PC12  (via drill 0.3, 0.34 pad 0.25)
  Top 0.254: STM32H743VIT6.80 240.88,100 239.69,98.97 224.53,98.97 200.5,123 200.5,137.75 198.75,139.5 v195.75,139.5
  Top 0.305: SD.CLK 186.62,144.12 187.94,142.8 v187.94,139.98 187.94,138.49 R24.2
  Bottom 0.305: v187.94,139.98 195.27,139.98 v195.75,139.5
PD2  (via drill 0.3, 0.34 pad 0.25)
  Top 0.254: STM32H743VIT6.83 242.37,99.85 240.74,98.44 224.31,98.44 200,122.75 200,137.21 v198.5,138.71
  Top 0.305: SD.CMD 184.42,143.49 184.63,143.28 v184.63,139.98 184.63,138.56 R23.2
  Bottom 0.305: v198.5,138.71 185.9,138.71 v184.63,139.98
PD3  (via drill 0.3, 0.34 pad 0.25)
  Top 0.254: 242.88,114.77 v242.77,114.84 242.86,114.75 STM32H743VIT6.84 | R15.1 75.92,147.33 76.25,147 108.5,147 v108.75,146.75
  Top 0.305: BTN1.3 | BTN1.1 BTN1.3 | R15.1 BTN1.3
  Bottom 0.254: v242.77,114.84 242.88,115.01 242.88,119.63 244.75,122.5 244.75,123 244.5,123.25 237.75,123.25 231.5,117 115.25,117 111.5,120.75 111.5,144 v108.75,146.75
PD4  (via drill 0.3, 0.34 pad 0.25)
  Top 0.254: v243.49,114.48 243.39,114.38 243.39,101.46 243.37,101.44 STM32H743VIT6.85 | R16.1 89.4,147.6 89.5,147.5 v109.5,147.5
  Top 0.305: 243.39,101.46 243.38,101.46 | BTN2.1 BTN2.3 R16.1
  Bottom 0.254: v243.49,114.48 243.39,115.39 243.39,119.39 245.25,122.25 245.25,123.25 244.75,123.75 237.5,123.75 231.25,117.5 115.5,117.5 112,121 112,145 v109.5,147.5
PD5  (via drill 0.3, 0.3 pad 0.3)
  Top 0.254: STM32H743VIT6.86 243.87,114.05 244.12,114.3 v244.12,114.86 | v246.38,120.22 246.66,120.51 246.66,124.74 245.53,125.87 215.05,125.87 211.66,129.26 211.66,143.56 215.67,147.57 257.56,147.57 v257.81,147.32
  Bottom 0.254: v244.12,114.86 244.12,119.38 244.97,120.22 v246.38,120.22 | J1.10 257.81,153.11 v257.81,147.32
PD6  (via drill 0.3, 0.3 pad 0.3)
  Top 0.254: STM32H743VIT6.87 244.37,113.98 v244.68,114.3 | v246.38,119.38 246.94,119.94 247.12,120.12 247.12,125.12 245.81,126.43 215.33,126.43 212.23,129.54 212.23,143.03 216.27,147.07 256.79,147.07 257.3,146.56 258.32,146.56 259.08,147.32 v260.1,147.32
  Bottom 0.254: v244.68,114.3 244.68,119.1 244.97,119.38 v246.38,119.38 | v260.1,147.32 260.35,147.57 260.35,153.16 261.56,154.37 J1.8
PD7
  Top 0.254: STM32H743VIT6.88 244.9,101.42 244.9,100.55 244.8,100.55 241.95,97.7 224.7,97.7 224.25,97.25 SJ3.2
PD10  (via drill 0.3, 0.34)
  Top 0.254: 235.86,112.42 | v233.15,113.15 235.15,113.15 235.86,112.44 235.86,112.42 | STM32H743VIT6.57 235.86,112.42 | 242.72,80.78 IC4.9 242.75,80.44 242.75,81.25 242.45,81.55 v241.25,81.55
  Bottom 0.254: v233.15,113.15 232.95,113.05 232.05,112.25 232.05,101.8 238.25,95.5 238.25,88.75 238,88.5 238,84.55 241,81.55 v241.25,81.55
PD10_
  Top 0.254: HUB75E2.9 224.23,78.73 225.45,79.95 227.55,79.95 231.5,76 239.5,76 240.25,75.25 242.07,75.25 | HUB75E1.9 263.58,78.62 244.7,78.62 242.07,76.25 242.07,75.25 | IC4.11 242.07,75.25
PD11  (via drill 0.3, 0.34)
  Top 0.254: v233.4,112.35 233.75,112.55 234.98,112.56 235.64,111.92 STM32H743VIT6.58 | IC4.8 243.38,81.88 242.8,82.45 v241.25,82.45
  Bottom 0.254: v233.4,112.35 232.6,111.75 232.6,102.1 238.75,95.75 238.75,88.5 238.5,88.25 238.5,85 241.05,82.45 v241.25,82.45
PD11_
  Top 0.254: HUB75E1.10 266.23,78.73 265,77.5 260.5,77.5 260,78 244.75,78 242.75,76 242.75,74.61 | 242.75,74.61 IC4.12 | 242.75,74.61 242.75,73.75 242.25,73.25 241.25,73.25 239.25,75.25 231.25,75.25 227.77,78.73 HUB75E2.10
PD12  (via drill 0.34)
  Top 0.254: STM32H743VIT6.59 235.38,111.42 234.9,111.9 v234.6,111.9 | IC4.7 244.03,82.72 243.35,83.4 v241.25,83.4
  Bottom 0.254: v234.6,111.9 233.85,111.9 233.1,111.25 233.1,102.35 239.25,96 239.25,88.25 239,88 239,85.5 241.1,83.4 v241.25,83.4
PD12_
  Top 0.254: HUB75E2.11 225.2,77.4 228.1,77.4 231,74.5 239,74.5 240.75,72.75 242.5,72.75 243.4,73.65 243.4,74.61 | 243.4,74.61 IC4.13 | HUB75E1.11 260.81,76.19 259.62,77.38 244.97,77.38 243.4,75.8 243.4,74.61
PD13  (via drill 0.3, 0.34)
  Top 0.254: 236.94,110.92 236.25,110.92 | 236.25,110.92 235.95,110.92 235.26,110.92 235.2,110.92 234.85,111.25 v234.02,111.25 | STM32H743VIT6.60 236.25,110.92 | IC4.6 244.68,83.08 243.45,84.3 v241.25,84.3
  Bottom 0.254: v234.02,111.25 233.85,111.25 233.65,111.05 233.65,102.45 233.7,102.4 239.75,96.25 239.75,88 239.5,87.75 239.5,86 241.2,84.3 v241.25,84.3
PD13_
  Top 0.254: HUB75E1.12 265.94,76.19 264.75,75 261,75 259.25,76.75 245,76.75 244.03,75.78 IC4.14 244.03,73.53 242.75,72.25 240.25,72.25 238.75,73.75 230.75,73.75 228.25,76.25 226.58,76.25 HUB75E2.12
PD14  (via drill 0.3, 0.34)
  Top 0.254: 236.25,110.41 235.94,110.41 235.54,110.41 235.37,110.41 235.17,110.41 234.77,110.63 v234.55,110.63 | 236.25,110.41 236.88,110.41 | STM32H743VIT6.61 236.25,110.42 236.25,110.41 | IC4.5 245.32,83.67 243.8,85.2 v241.25,85.2
  Bottom 0.254: v234.55,110.63 234.53,110.63 234.15,110.25 234.19,102.79 234.19,102.66 240.25,96.5 240.25,87.75 240,87.5 240,86.3 241.1,85.2 v241.25,85.2
PD14_  (via drill 0.35)
  Top 0.254: HUB75E1.8 266.27,81.17 265.1,80 263,80 262.25,79.25 v244.7,79.25 244.45,79.5 237,79.5 235.23,81.27 HUB75E2.8 | IC4.15 244.68,75.62 v244.7,75.65
  Bottom 0.254: v244.7,75.65 v244.7,79.25
PD15
  Top 0.254: STM32H743VIT6.62 234.33,109.92 232,112.25 SJ2.2
PD15_
  Top 0.254: HUB75E1.14 266.27,73.52 265.15,72.4 262.6,72.4 259.62,75.38 259,76 258.88,76.12 245.78,76.12 245.35,75.7 245.35,74.61 IC4.16 245.32,73.83 243.25,71.75 239.75,71.75 238.5,73 227.75,73 227.1,73.65 HUB75E2.14
PDRON
  Top 0.254: 250.38,97.34 R4.1 250.39,101.4 STM32H743VIT6.99
PE0  (via drill 0.34 pad 0.25)
  Top 0.254: STM32H743VIT6.97 249.37,99.79 249.38,99.78 249.38,99.63 v247.75,98 | IC6.4 v249.75,63.27
  Bottom 0.254: v247.75,98 247.75,87.75 249.75,85.75 v249.75,63.27
PE1  (via drill 0.34 pad 0.25)
  Top 0.254: STM32H743VIT6.98 249.87,99.12 v248.75,98 | IC6.5 250.47,63.92 v250.5,63.95
  Bottom 0.254: v248.75,98 248.75,87.75 250.5,86 v250.5,63.95
PE2  (via drill 0.34 pad 0.25)
  Top 0.254: v254.38,102.31 253.27,103.42 252.94,103.42 STM32H743VIT6.1 | IC6.6 251.22,64.58 v251.25,64.6
  Bottom 0.254: v254.38,102.31 254.38,97.38 251.25,94.25 v251.25,64.6
PE3  (via drill 0.34 pad 0.25)
  Top 0.254: v255.38,102.3 253.76,103.92 STM32H743VIT6.2 | IC6.7 v251.93,65.22
  Bottom 0.254: v255.38,102.3 255.38,97.62 252,94.25 252,65.3 v251.93,65.22
PE4  (via drill 0.34 pad 0.25)
  Top 0.254: v256.43,102.29 254.3,104.42 STM32H743VIT6.3 | IC6.8 252.72,65.88 v252.75,65.9
  Bottom 0.254: v256.43,102.29 256.43,97.92 252.75,94.25 v252.75,65.9
PE5  (via drill 0.34 pad 0.25)
  Top 0.254: v257.43,102.27 254.78,104.92 STM32H743VIT6.4 | IC6.9 253.47,66.53 v253.5,66.55
  Bottom 0.254: v257.43,102.27 257.43,98.17 253.5,94.25 v253.5,66.55
PE6  (via drill 0.34 pad 0.25)
  Top 0.254: STM32H743VIT6.5 255.44,105.42 255.44,105.31 v258.5,102.25 | v254.5,94.25 241.5,94.25 241,93.75 241,92.75 241.62,92.12 IC5.3 | IC6.3 247.69,62.6 250.6,62.6 254.25,66.25 v254.25,67.2
  Bottom 0.254: v254.25,67.2 254.25,94 v254.5,94.25 258.5,98.25 v258.5,102.25
PE9  (via drill 0.34, 0.34 pad 0.25)
  Top 0.254: STM32H743VIT6.39 244.37,122.13 v244,122.5 | IC5.4 234.03,91.47 v233.65,91.85
  Bottom 0.254: v244,122.5 237.75,122.5 229,113.75 229,100.25 233.65,95.6 v233.65,91.85
PE10  (via drill 0.34, 0.34 pad 0.25)
  Top 0.254: STM32H743VIT6.40 243.87,121.38 v243.5,121.75 | IC5.5 v234.32,90.83
  Bottom 0.254: v243.5,121.75 237.75,121.75 229.5,113.5 229.5,100.5 234.4,95.6 234.4,91 v234.32,90.83
PE11  (via drill 0.34, 0.34 pad 0.25)
  Top 0.254: IC5.6 235.32,90.17 v235.15,90.15 | STM32H743VIT6.41 243.37,120.63 v243,121
  Bottom 0.254: v243,121 237.75,121 230,113.25 230,100.75 235.15,95.6 v235.15,90.15
PE12  (via drill 0.34, 0.34 pad 0.25)
  Top 0.254: STM32H743VIT6.42 242.87,119.88 v242.5,120.25 | IC5.7 236.03,89.53 v235.9,89.5
  Bottom 0.254: v242.5,120.25 237.75,120.25 230.5,113 230.5,101 235.9,95.6 v235.9,89.5
PE13  (via drill 0.34, 0.34 pad 0.25)
  Top 0.254: IC5.8 236.82,88.88 v236.7,88.9 | STM32H743VIT6.43 242.37,119.13 v242,119.5
  Bottom 0.254: v242,119.5 237.75,119.5 231,112.75 231,101.25 236.65,95.6 236.65,89 | 236.65,89 236.75,88.95 v236.7,88.9 236.7,88.95 236.65,89
PE14  (via drill 0.34, 0.34 pad 0.25)
  Top 0.254: STM32H743VIT6.44 241.87,118.38 v241.5,118.75 | IC5.9 237.53,88.22 v237.3,88.05
  Bottom 0.254: v241.5,118.75 237.75,118.75 231.5,112.5 231.5,101.5 237.4,95.6 237.4,88.15 v237.3,88.05
PE15  (via drill 0.38)
  Top 0.254: IC4.4 245.97,84.03 243.9,86.1 242.15,86.1 v242,86.25 | STM32H743VIT6.45 241.37,115.88 v241.5,115.75
  Bottom 0.254: v242,86.25 242,87.5 241.25,88.25 241.25,97.25 235.25,103.25 235.25,108 236,108.75 236,114.5 237.25,115.75 v241.5,115.75
PH0
  Top 0.254: R6.2 256,108.92 STM32H743VIT6.12
PH1
  Top 0.254: 256.72,109.42 R7.2 256.72,109.42 STM32H743VIT6.13
PIN_DMD_DCLK
  Top 0.254: R10.2 170.69,11.69 C18.2 166.96,13.26 163.05,13.26 161.94,14.37 SJ1.2 150.82,14.37 150.24,13.79 150.24,12.48 IC1.2
PIN_DMD_DCLK_
  Top 0.254: IC1.13 152.86,17.38 154.27,15.97 161.5,15.97 SJ1.1 161.58,17.58 164.25,20.25 170.75,20.25 176,25.5 195,25.5 214,44.5 214,84.75 226.5,97.25 242.25,97.25 245.37,100.37 STM32H743VIT6.89 245.37,114.63 244.5,115.5 242.35,115.5 241.75,115 241,115 240.87,115.13 STM32H743VIT6.46
R0_1  (via drill 0.35)
  Top 0.254: IC6.16 239.32,63.92 v239,64.25
  Bottom 0.254: HUB75E2.1 224.11,88.89 225.4,87.6 227.4,87.6 239,76 v239,64.25
R0_2
  Top 0.254: IC5.16 261.8,90.83 HUB75E1.1
R1_1  (via drill 0.35)
  Top 0.254: IC6.13 241.12,65.88 240.5,66.5 237.25,66.5 v236.75,67
  Bottom 0.254: HUB75E2.5 arc45 224.01,83.74 225.25,82.5 228.75,82.5 236.75,74.5 v236.75,67
R1_2
  Top 0.254: IC5.13 257.88,88.88 262.94,83.81 HUB75E1.5
RESET  (via drill 0.34 pad 0.25)
  Top 0.254: v258.83,110.86 255.88,110.86 254.94,109.92 STM32H743VIT6.14 | 119.56,147.24 119.56,147.06 119.5,147 v115.25,147
  Top 0.305: RESET.3 RESET.1 117.97,154.25 117.97,149.93 119.56,148.34 | 119.56,148.34 R3.1 119.56,147.24 | 119.56,148.34 119.56,149.11 120.05,149.6 124.18,149.6 C2.1
  Bottom 0.254: v258.83,110.86 258.83,123.17 256.75,125.25 247.75,125.25 247.25,125.75 236.5,125.75 230.25,119.5 137.5,119.5 136.5,120.5 114,120.5 113,121.5 113,144.75 v115.25,147
RX1
  Top 0.254: U1.13 150.68,142.12 148.76,144.03 148.76,147.27 147.71,148.33 147.71,149.96 148.5,150.75 151,150.75 151.75,151.5 151.75,153.19 RS232.3
TX1
  Top 0.254: U1.14 151.94,143.65 151.3,144.29 151.3,147.39 151.94,148.02 151.94,149.69 152.75,150.5 155.75,150.5 156.75,151.5 156.75,153.27 RS232.1
VBAT
  Top 0.254: 260.58,106.69 R2.1 260.54,106.69 256.2,106.69 | 264,106.72 C1.+ | 255.42,105.92 STM32H743VIT6.6
  Top 0.305: 255.42,105.92 256.2,106.69
  Top 0.406: R2.1 263.94,106.69 C1.+
VCAP1
  Top 0.254: 239.38,121.83 C3.1 239.35,121.86 239.35,120.73 239.87,120.21 STM32H743VIT6.48
VCAP2
  Top 0.254: STM32H743VIT6.73 232.65,104.42
  Top 0.305: 232.65,104.42 231.23,105.83 230.28,105.83 C4.1
VDDA
  Top 0.254: STM32H743VIT6.21 254.01,113.42 254,113.42
  Top 0.305: 254,113.42 255.27,114.69 255.27,117.1 C16.1
  Top 0.406: C16.1 259.77,118.47 261.35,120.05 R8.2 | 262.4,120.35 R8.2 | R8.2 277.85,120.04 C15.1 281.78,119.95 L1.2
VIN
  Top 0.254: D3.C 297.89,25.67 298.08,25.48
  Top 0.813: 313.3,29.3 IC2.5
  Top 1.27: 313.3,29.3 C36.1
  Top 1.93: C38.1 309.83,25.6 309.83,27.98 312.33,27.98 312.33,28.98 313.3,29.3
  Top 2.54: 312.33,28.98 312.33,33.23 308.33,33.23 | 308.33,33.23 303.08,33.23 298.08,28.23 298.08,25.48 298.08,24.98 298.06,21 | 298.06,21 297.94,21.16 298.5,19.25 X1.3 | PWR.1 273.68,18.43 276.25,21 298.06,21 | C39.+ 308.26,33.3 308.33,33.23
VREF
  Top 0.254: R8.1 259.49,115.83 C14.1 254.28,112.92 STM32H743VIT6.20 | 265.68,118.74 C13.1
  Top 0.305: R8.1 262.52,118.26 C13.1

## Text on the board
tNames: TX | GND | RX | GND | TX | C31 | R29 | R30 | R28 | C33 | C30 | +3V3 | CLK | GND | DIO | C32 | R33 | R19 | R18 | R21 | R22 | R23 | R24 | R25 | R26 | C34 | C3 | + | + | + | C7 | + | + | C14 | C4 | + | C10 | + | C12 | C27 | C28 | C42 | COLORPRISM HD 256x64 | R11 | C19 | 8-36V DC | C35 | C17 | R9 | R13 | C21 | C29 | R27 | R14 | C26 | V+ | C41 | R12 | C20 | C18 | R10 | GND | GND | EVO HD 256X64 BOARD REV 1.2 / (C) 2025 WWW.PIN2DMD.COM | C40 | V+ | KEY
bNames: - | + | + | - | - | + | - | + | + | - | + | -